# EAGLE design 3_phase (EAGLE 9.6.2)
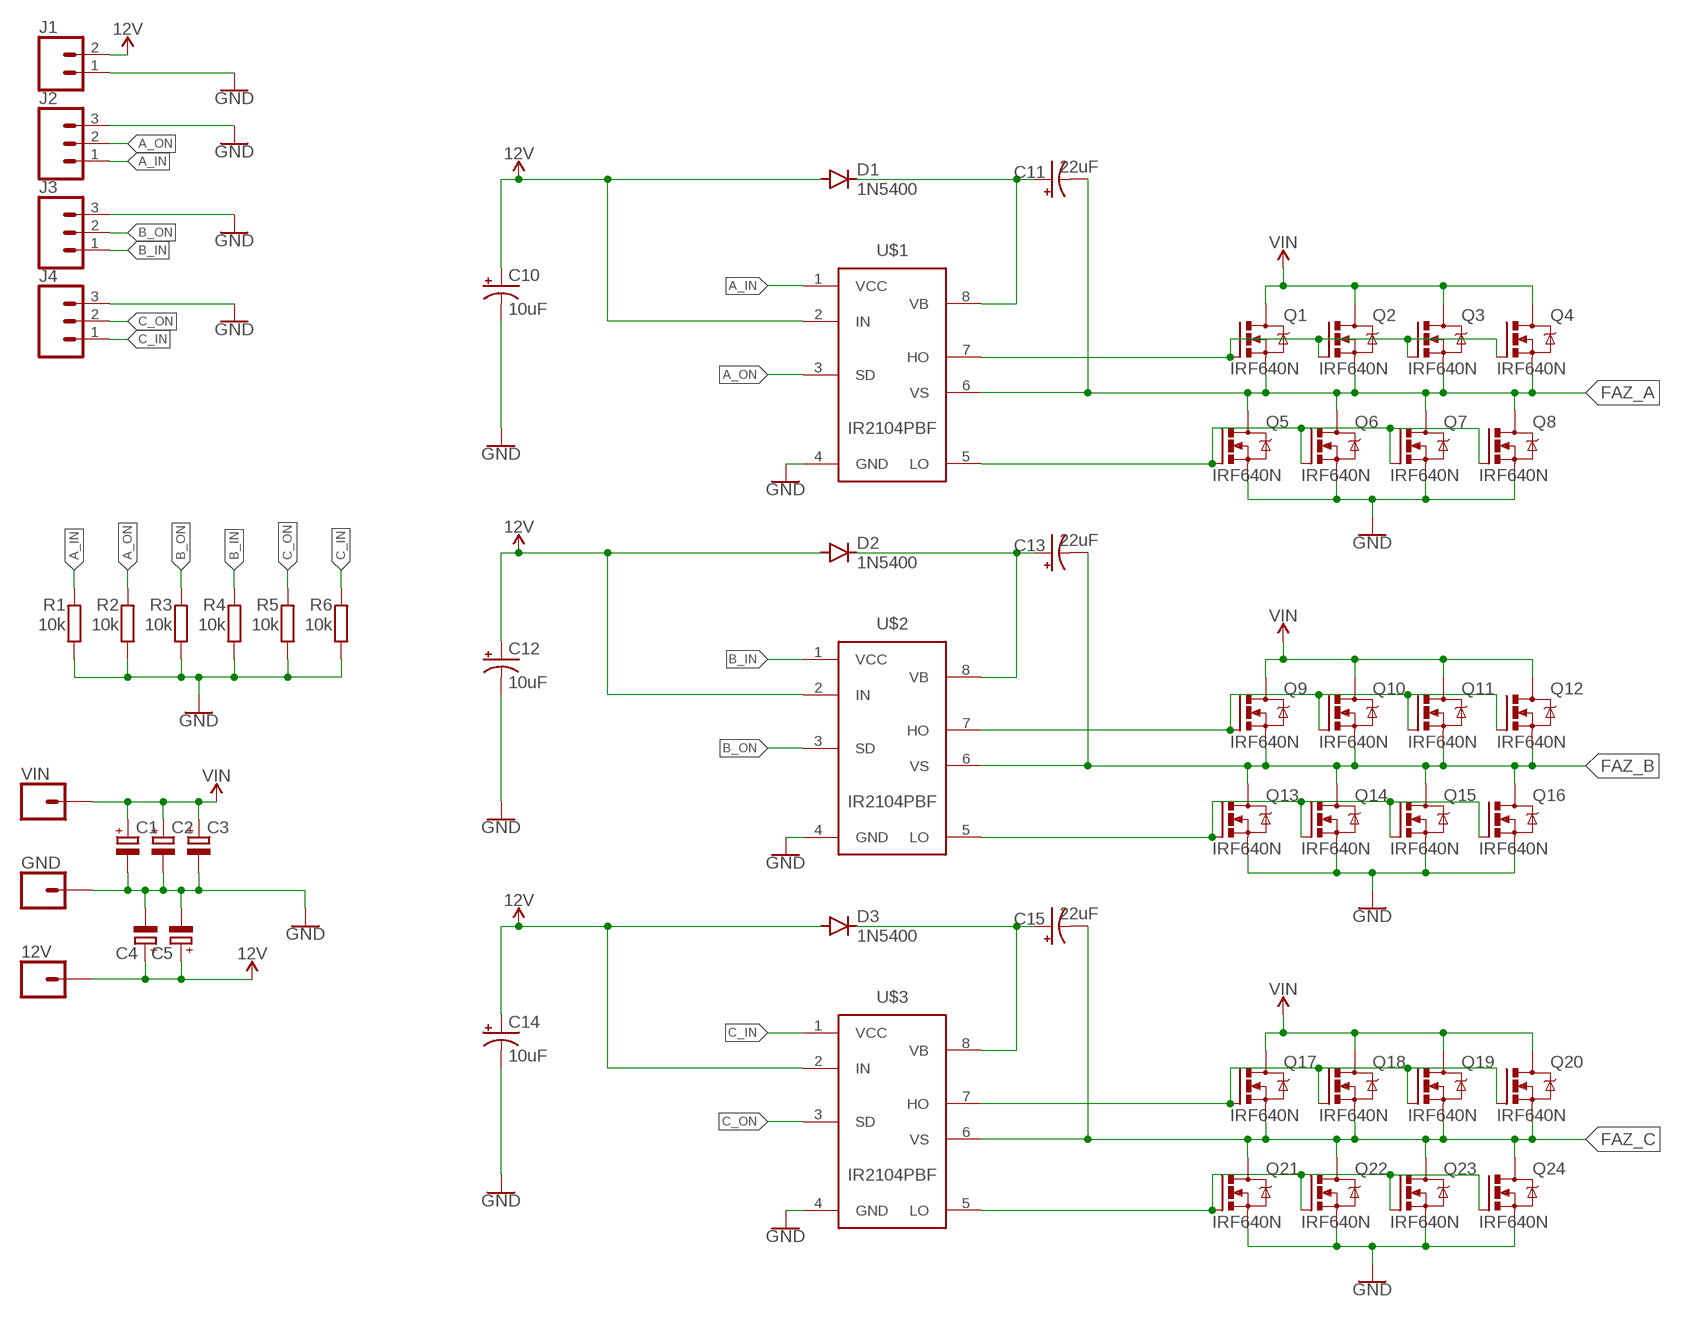
[diagram p0: schematic, sheet 1]

## Parts
12V  CONN_01SNAP-MALE  [SNAP-MALE]
C1  16MM-DIA-CAPASITOR  [16MM-DIA-CAPASITOR]
C2  16MM-DIA-CAPASITOR  [16MM-DIA-CAPASITOR]
C3  16MM-DIA-CAPASITOR  [16MM-DIA-CAPASITOR]
C4  16MM-DIA-CAPASITOR  [16MM-DIA-CAPASITOR]
C5  16MM-DIA-CAPASITOR  [16MM-DIA-CAPASITOR]
C10  10uF  10UF-POLAR-RADIAL-2.5MM-25V-20%  [CPOL-RADIAL-2.5MM-5MM]
C11  22uF  10UF-POLAR-RADIAL-2.5MM-25V-20%  [CPOL-RADIAL-2.5MM-5MM]
C12  10uF  10UF-POLAR-RADIAL-2.5MM-25V-20%  [CPOL-RADIAL-2.5MM-5MM]
C13  22uF  10UF-POLAR-RADIAL-2.5MM-25V-20%  [CPOL-RADIAL-2.5MM-5MM]
C14  10uF  10UF-POLAR-RADIAL-2.5MM-25V-20%  [CPOL-RADIAL-2.5MM-5MM]
C15  22uF  10UF-POLAR-RADIAL-2.5MM-25V-20%  [CPOL-RADIAL-2.5MM-5MM]
D1  1N5400  [DO201-15]
D2  1N5400  [DO201-15]
D3  1N5400  [DO201-15]
GND  CONN_01SNAP-MALE  [SNAP-MALE]
J1  CONN_025MM  [SCREWTERMINAL-5MM-2]
J2  CONN_03-SCREW-5MM  [SCREWTERMINAL-5MM-3]
J3  CONN_03-SCREW-5MM  [SCREWTERMINAL-5MM-3]
J4  CONN_03-SCREW-5MM  [SCREWTERMINAL-5MM-3]
Q1  IRF640N  [TO-220-PAD]
Q2  IRF640N  [TO-220-PAD]
Q3  IRF640N  [TO-220-PAD]
Q4  IRF640N  [TO-220-PAD]
Q5  IRF640N  [TO-220-PAD]
Q6  IRF640N  [TO-220-PAD]
Q7  IRF640N  [TO-220-PAD]
Q8  IRF640N  [TO-220-PAD]
Q9  IRF640N  [TO-220-PAD]
Q10  IRF640N  [TO-220-PAD]
Q11  IRF640N  [TO-220-PAD]
Q12  IRF640N  [TO-220-PAD]
Q13  IRF640N  [TO-220-PAD]
Q14  IRF640N  [TO-220-PAD]
Q15  IRF640N  [TO-220-PAD]
Q16  IRF640N  [TO-220-PAD]
Q17  IRF640N  [TO-220-PAD]
Q18  IRF640N  [TO-220-PAD]
Q19  IRF640N  [TO-220-PAD]
Q20  IRF640N  [TO-220-PAD]
Q21  IRF640N  [TO-220-PAD]
Q22  IRF640N  [TO-220-PAD]
Q23  IRF640N  [TO-220-PAD]
Q24  IRF640N  [TO-220-PAD]
R1  10k  R-EU_0207/10  [0207/10]
R2  10k  R-EU_0207/10  [0207/10]
R3  10k  R-EU_0207/10  [0207/10]
R4  10k  R-EU_0207/10  [0207/10]
R5  10k  R-EU_0207/10  [0207/10]
R6  10k  R-EU_0207/10  [0207/10]
U$1  IR2104PBF  [DIP-8]
U$2  IR2104PBF  [DIP-8]
U$3  IR2104PBF  [DIP-8]
VIN  CONN_01SNAP-MALE  [SNAP-MALE]

## Nets
12V: 12V.2 C4.+ C5.+ C10.1(+) C12.1(+) C14.1(+) D1.A D2.A D3.A J1.2 U$1.2(IN) U$2.2(IN) U$3.2(IN)
A_IN: J2.1 R1.2 U$1.1(VCC)
A_ON: J2.2 R2.2 U$1.3(SD)
B_IN: J3.1 R4.2 U$2.1(VCC)
B_ON: J3.2 R3.2 U$2.3(SD)
C_IN: J4.1 R6.2 U$3.1(VCC)
C_ON: J4.2 R5.2 U$3.3(SD)
FAZ_A: C11.2(-) Q1.3(S) Q2.3(S) Q3.3(S) Q4.3(S) Q5.TAB(D) Q6.TAB(D) Q7.TAB(D) Q8.TAB(D) U$1.6(VS)
FAZ_A_H: Q1.1(G) Q2.1(G) Q3.1(G) Q4.1(G) U$1.7(HO)
FAZ_A_L: Q5.1(G) Q6.1(G) Q7.1(G) Q8.1(G) U$1.5(LO)
FAZ_B: C13.2(-) Q9.3(S) Q10.3(S) Q11.3(S) Q12.3(S) Q13.TAB(D) Q14.TAB(D) Q15.TAB(D) Q16.TAB(D) U$2.6(VS)
FAZ_B_L: Q13.1(G) Q14.1(G) Q15.1(G) Q16.1(G) U$2.5(LO)
FAZ_B_L1: Q21.1(G) Q22.1(G) Q23.1(G) Q24.1(G) U$3.5(LO)
FAZ_C: C15.2(-) Q17.3(S) Q18.3(S) Q19.3(S) Q20.3(S) Q21.TAB(D) Q22.TAB(D) Q23.TAB(D) Q24.TAB(D) U$3.6(VS)
FAZ_C_H: Q17.1(G) Q18.1(G) Q19.1(G) Q20.1(G) U$3.7(HO)
GND: C1.- C2.- C3.- C4.- C5.- C10.2(-) C12.2(-) C14.2(-) GND.2 J1.1 J2.3 J3.3 J4.3 Q5.3(S) Q6.3(S) Q7.3(S) Q8.3(S) Q13.3(S) Q14.3(S) Q15.3(S) Q16.3(S) Q21.3(S) Q22.3(S) Q23.3(S) Q24.3(S) R1.1 R2.1 R3.1 R4.1 R5.1 R6.1 U$1.4(GND) U$2.4(GND) U$3.4(GND)
N$1: Q9.1(G) Q10.1(G) Q11.1(G) Q12.1(G) U$2.7(HO)
N$2: C11.1(+) D1.C U$1.8(VB)
N$3: C15.1(+) D3.C U$3.8(VB)
N$4: C13.1(+) D2.C U$2.8(VB)
VIN: C1.+ C2.+ C3.+ Q1.TAB(D) Q2.TAB(D) Q3.TAB(D) Q4.TAB(D) Q9.TAB(D) Q10.TAB(D) Q11.TAB(D) Q12.TAB(D) Q17.TAB(D) Q18.TAB(D) Q19.TAB(D) Q20.TAB(D) VIN.2

## Library data of the parts
12V GND VIN = SparkFun-Connectors:CONN_01: Single connection point. Often used as Generic Header-pin footprint for 0.1 inch spaced/style header connections On any of the 0.1 inch spaced packages, you can populate with these: Break Away Headers - Straight <https://www.sparkfun.com/products/116> (PRT-00116) Break Away Male Headers - Right Angle <https://www.sparkfun.com/products/553> (PRT-00553) Female Headers <https://www.sparkfun.com/products/115> (PRT-00115) Break Away Headers - Machine Pin <https://www.sparkfun.com/products/117> (PRT-00117) Break Away Female Headers - Swiss Machine Pin <https://www.sparkfun.com/products/743> (PRT-00743) This device is also useful as a general connection point to wire up your design to another part of your project. Our various solder wires solder well into these plated through hole pads. Hook-Up Wire - Assortment (Stranded, 22 AWG) <https://www.sparkfun.com/products/11375> (PRT-11375) Hook-Up Wire - Assortment (Solid Core, 22 AWG) <https://www.sparkfun.com/products/11367> (PRT-11367) View the entire wire category on our website here <https://www.sparkfun.com/categories/141> Special notes: SMTSO-256-ET is a "flush mount" nut for a 4-40 screw. We mostly use this on specialty testbeds; it is a nice way to connect hardware to your PCB at an adjustable hieght. Also note, the SNAP packages are for using a snappable style connector. We sell a baggie of snaps and they are also used on two LilyPad designs: Snap Assortment - 30 pack (male and female) <https://www.sparkfun.com/products/11347> (DEV-11347) LilyPad Arduino SimpleSnap <https://www.sparkfun.com/products/10941> (DEV-10941) LilyPad SimpleSnap Protoboard <https://www.sparkfun.com/products/10940> (DEV-10940)
C1-C5 = El_yapimi:16MM-DIA-CAPASITOR
C10 C12 C14 = SparkFun-Capacitors:10UF-POLAR: 10.0µF polarized capacitors A capacitor is a passive two-terminal electrical component used to store electrical energy temporarily in an electric field.; PROD_ID: CAP-08440
C11 C13 C15 = SparkFun-Capacitors:10UF-POLAR: 10.0µF polarized capacitors A capacitor is a passive two-terminal electrical component used to store electrical energy temporarily in an electric field.; PROD_ID: CAP-08440; VALUE: 10uF
D1-D3 = diode:1N5400: DIODE standard rectifier, 3 A, 50 V (Motorola)
J1 = SparkFun-Connectors:CONN_02: Multi connection point. Often used as Generic Header-pin footprint for 0.1 inch spaced/style header connections On any of the 0.1 inch spaced packages, you can populate with these: Break Away Headers - Straight <https://www.sparkfun.com/products/116> (PRT-00116) Break Away Male Headers - Right Angle <https://www.sparkfun.com/products/553> (PRT-00553) Female Headers <https://www.sparkfun.com/products/115> (PRT-00115) Break Away Headers - Machine Pin <https://www.sparkfun.com/products/117> (PRT-00117) Break Away Female Headers - Swiss Machine Pin <https://www.sparkfun.com/products/743> (PRT-00743) For SCREWTERMINALS and SPRING TERMINALS visit here: Screw Terimnals on SparkFun.com <https://www.sparkfun.com/search/results?term=Screw+Terminals> (5mm/3.5mm/2.54mm spacing) This device is also useful as a general connection point to wire up your design to another part of your project. Our various solder wires solder well into these plated through hole pads. Hook-Up Wire - Assortment (Stranded, 22 AWG) <https://www.sparkfun.com/products/11375> (PRT-11375) Hook-Up Wire - Assortment (Solid Core, 22 AWG) <https://www.sparkfun.com/products/11367> (PRT-11367) View the entire wire category on our website here <https://www.sparkfun.com/categories/141> Special notes: Molex polarized connector foot print use with: PRT-08233 with associated crimp pins and housings. 2.54_SCREWTERM for use with PRT-10571. 3.5mm Screw Terminal footprints for PRT-08084 5mm Screw Terminal footprints for use with PRT-08432; SF_SKU: PRT-08432
J2-J4 = SparkFun-Connectors:CONN_03: Multi connection point. Often used as Generic Header-pin footprint for 0.1 inch spaced/style header connections On any of the 0.1 inch spaced packages, you can populate with these: Break Away Headers - Straight <https://www.sparkfun.com/products/116> (PRT-00116) Break Away Male Headers - Right Angle <https://www.sparkfun.com/products/553> (PRT-00553) Female Headers <https://www.sparkfun.com/products/115> (PRT-00115) Break Away Headers - Machine Pin <https://www.sparkfun.com/products/117> (PRT-00117) Break Away Female Headers - Swiss Machine Pin <https://www.sparkfun.com/products/743> (PRT-00743) Stackable Header - 3 Pin (Female, 0.1") <https://www.sparkfun.com/products/13875> (PRT-13875) For SCREWTERMINALS and SPRING TERMINALS visit here: Screw Terimnals on SparkFun.com <https://www.sparkfun.com/search/results?term=Screw+Terminals> (5mm/3.5mm/2.54mm spacing) This device is also useful as a general connection point to wire up your design to another part of your project. Our various solder wires solder well into these plated through hole pads. Hook-Up Wire - Assortment (Stranded, 22 AWG) <https://www.sparkfun.com/products/11375> (PRT-11375) Hook-Up Wire - Assortment (Solid Core, 22 AWG) <https://www.sparkfun.com/products/11367> (PRT-11367) View the entire wire category on our website here <https://www.sparkfun.com/categories/141> Special notes: Molex polarized connector foot print use with SKU : PRT-08232 with associated crimp pins and housings.; PROD_ID: CONN-10134; SF_SKU: PRT-08433
Q1-Q24 = El_yapimi:IRF640N
R1-R6 = resistor:R-EU_: RESISTOR, European symbol
U$1-U$3 = El_yapimi:IR2104PBF

## Board
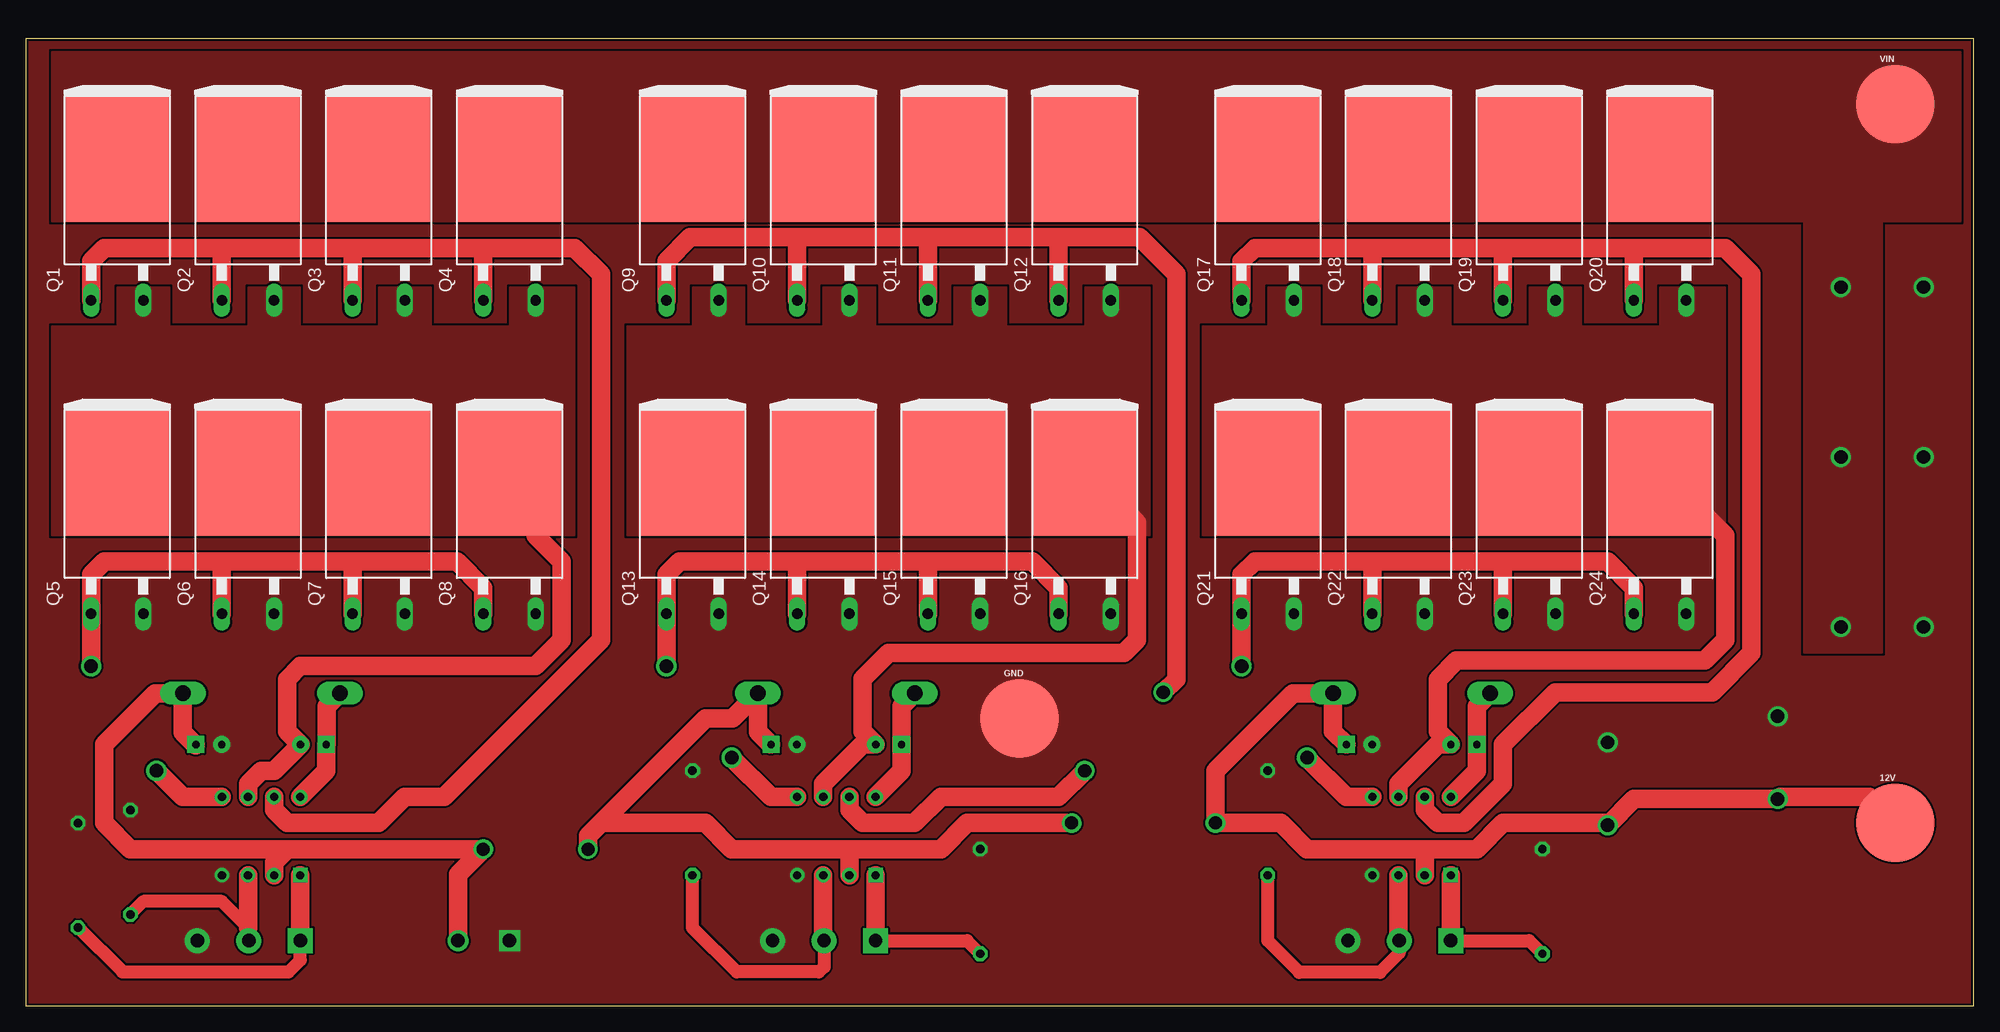
[diagram p1: board, top side]
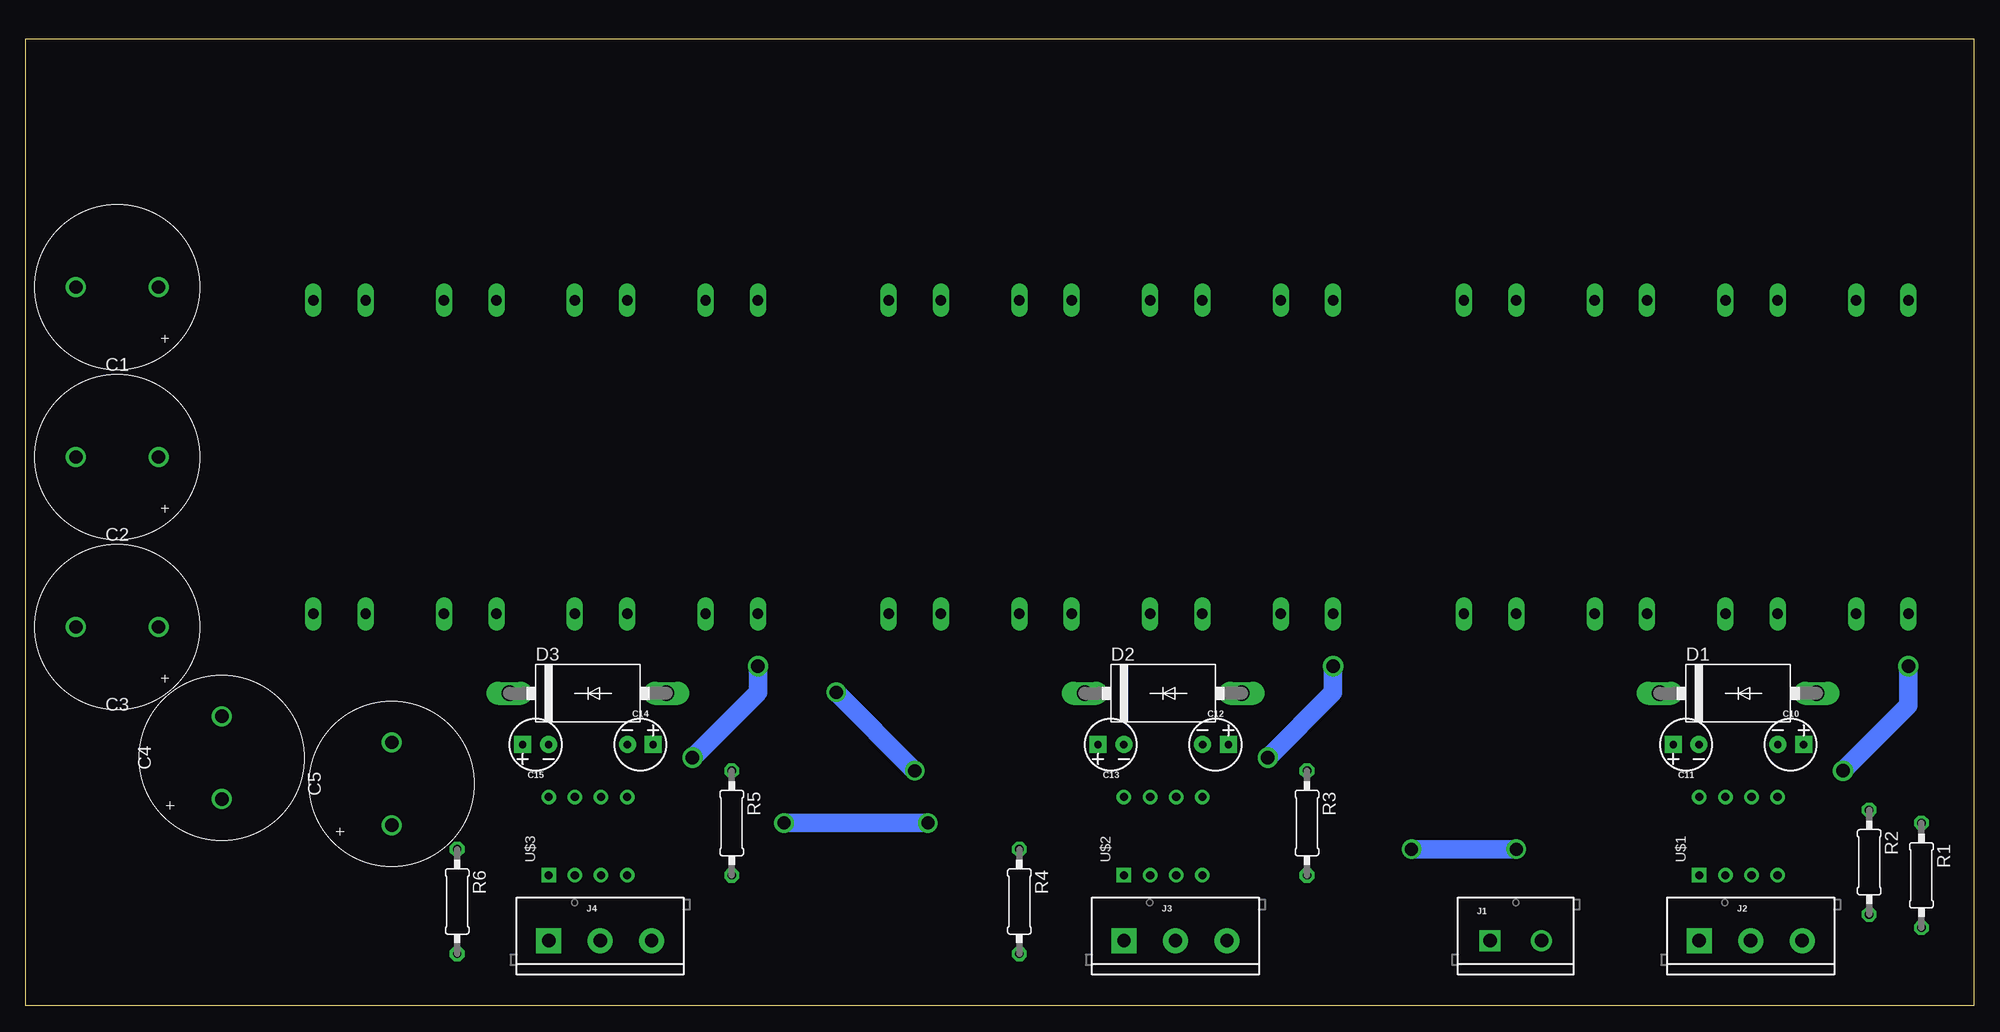
[diagram p2: board, bottom side, seen from below]

Size 189.23 x 93.98 mm. Coordinates in mm from the lower left corner, seen from the top.
Outline: 0,0 189.23,0 189.23,93.98 0,93.98 0,0
Copper layers (1*16): Top 0.035mm / dielectric 1.5mm / Bottom 0.035mm
Design rules "SparkFun": minimum track width 8mil, minimum drill 20mil, track to track 8mil, track to pad 8mil, pad to pad 8mil, via to via 8mil, smd to smd 8mil, copper to edge 10mil, drill to drill 8mil, minimum pad ring 12mil, minimum via ring 10mil, stop-mask expansion 4mil, vias tented up to drill 25mil, thermal gap 10mil

### Footprints (pad centres in the part's own frame; a part is rotated, then mirrored left to right if it is on the bottom)
SNAP-MALE = smd 7.62 x 7.62: 2 0,0
16MM-DIA-CAPASITOR = drill 1.3 pad 1.95: + -4.02,0; - 4.02,0
CPOL-RADIAL-2.5MM-5MM = drill 0.7 pad 1.651 square: 1 1.25,0 | drill 0.7 pad 1.651: 2 -1.25,0
DO201-15 = drill 1.499 long: A 7.62,0; C -7.62,0
SCREWTERMINAL-5MM-2 = drill 1.3 pad 2.032 square: 1 0,0 | drill 1.3 pad 2.032: 2 5,0
SCREWTERMINAL-5MM-3 = drill 1.3 pad 2.413 square: 1 0,0 | drill 1.3 pad 2.413: 2 5,0; 3 10,0
TO-220-PAD = drill 1.016 long: 1 -2.54,-8.89; 3 2.54,-8.89 | smd 10.16 x 12.7: TAB 0,5.08
0207/10 = drill 0.813 octagon: 1 -5.08,0; 2 5.08,0
DIP-8 = drill 0.8 square: 1 -3.81,3.81 | drill 0.8: 2 -3.81,1.27; 3 -3.81,-1.27; 4 -3.81,-3.81; 5 3.81,-3.81; 6 3.81,-1.27; 7 3.81,1.27; 8 3.81,3.81

### Placement (x,y rotation side)
12V  181.61,17.78 0 top
C1  180.34,69.85 180 bottom
C2  180.34,53.34 180 bottom
C3  180.34,36.83 180 bottom
C4  170.18,24.13 90 bottom
C5  153.67,21.59 90 bottom
C10  17.78,25.4 0 bottom
C11  27.94,25.4 180 bottom
C12  73.66,25.4 0 bottom
C13  83.82,25.4 180 bottom
C14  129.54,25.4 0 bottom
C15  139.7,25.4 180 bottom
D1  22.89,30.38 0 bottom
D2  78.74,30.38 0 bottom
D3  134.62,30.38 0 bottom
GND  96.52,27.94 0 top
J1  46.99,6.35 0 bottom
J2  26.67,6.35 0 bottom
J3  82.55,6.35 0 bottom
J4  138.43,6.35 0 bottom
Q1  8.89,77.47 0 top
Q2  21.59,77.47 0 top
Q3  34.29,77.47 0 top
Q4  46.99,77.47 0 top
Q5  8.89,46.99 0 top
Q6  21.59,46.99 0 top
Q7  34.29,46.99 0 top
Q8  46.99,46.99 0 top
Q9  64.77,77.47 0 top
Q10  77.47,77.47 0 top
Q11  90.17,77.47 0 top
Q12  102.87,77.47 0 top
Q13  64.77,46.99 0 top
Q14  77.47,46.99 0 top
Q15  90.17,46.99 0 top
Q16  102.87,46.99 0 top
Q17  120.65,77.47 0 top
Q18  133.35,77.47 0 top
Q19  146.05,77.47 0 top
Q20  158.75,77.47 0 top
Q21  120.65,46.99 0 top
Q22  133.35,46.99 0 top
Q23  146.05,46.99 0 top
Q24  158.75,46.99 0 top
R1  5.08,12.7 270 bottom
R2  10.16,13.97 270 bottom
R3  64.77,17.78 270 bottom
R4  92.71,10.16 270 bottom
R5  120.65,17.78 270 bottom
R6  147.32,10.16 270 bottom
U$1  22.86,16.51 90 bottom
U$2  78.74,16.51 90 bottom
U$3  134.62,16.51 90 bottom
VIN  181.61,87.63 0 top

### Tracks (layer width: path | path; a pad name or v marks a point on that pad's centre or on a via)
12V  (via drill 1.27)
  Top 1.778: 12V.2 179.07,20.32 170.39,20.32 C4.+ 156.21,20.11 C5.+ 153.46,17.78 143.51,17.78 140.97,15.24 135.89,15.24 | U$1.2 24.13,13.97 25.4,15.24 | 25.4,15.24 10.16,15.24 7.62,17.78 7.62,25.4 12.6,30.38 D1.A 15.27,26.57 16.49,25.34 16.49,25.36 C10.1 | 80.01,15.24 88.9,15.24 91.44,17.78 v101.6,17.78 | 80.01,15.24 68.58,15.24 66.04,17.78 55.88,17.78 | 25.4,15.24 v44.45,15.24 41.99,12.78 J1.2 | 135.89,15.24 124.46,15.24 121.92,17.78 v115.57,17.78 115.57,22.86 123.09,30.38 D3.A 127,26.67 128.27,25.4 C14.1 | 55.88,17.78 66.04,27.94 68.68,27.94 D2.A 71.12,26.65 72.37,25.4 C12.1 | U$2.2 80.01,15.24 | U$3.2 135.89,15.24 | 55.88,17.78 54.61,16.51 v54.61,15.24
  Bottom 1.778: v44.45,15.24 v54.61,15.24 | v101.6,17.78 v115.57,17.78
A_IN
  Top 1.27: R1.2 9.4,3.3 25.53,3.3 26.67,4.45 J2.1
  Top 1.778: J2.1 U$1.1
A_ON
  Top 1.27: 21.59,6.43 21.59,7.62 19.05,10.16 11.43,10.16 R2.2
  Top 1.778: 21.59,6.43 J2.2 | U$1.3 21.59,7.62
B_IN
  Top 1.27: J3.1 91.44,6.35 R4.2
  Top 1.778: J3.1 U$2.1
B_ON
  Top 1.27: J3.2 77.55,3.81 77.04,3.3 69.09,3.3 64.77,7.62 R3.2
  Top 1.778: J3.2 77.47,6.43 U$2.3
C_IN
  Top 1.27: J4.1 146.05,6.35 R6.2
  Top 1.778: J4.1 U$3.1
C_ON
  Top 1.27: J4.2 133.43,5.16 131.55,3.28 123.72,3.28 120.65,6.35 R5.2
  Top 1.778: J4.2 133.35,6.43 U$3.3
FAZ_A
  Top 1.778: 49.53,48.26 49.53,45.72 52.07,43.18 52.07,35.56 49.53,33.02 26.67,33.02 25.4,31.75 25.4,26.67 26.67,25.4 C11.2 24.15,22.86 22.86,22.86 21.59,21.59 U$1.6
  pour Top (no thermals): 8.89,69.85 8.89,66.04 2.54,66.04 2.54,45.72 53.34,45.72 53.34,69.85 46.99,69.85 46.99,66.04 39.37,66.04 39.37,69.85 34.29,69.85 34.29,66.04 26.67,66.04 26.67,69.85 21.59,69.85 21.59,66.04 13.97,66.04 13.97,69.85
FAZ_A_H
  Top 1.778: Q1.1 6.35,72.39 7.62,73.66 19.05,73.66 | 19.05,73.66 31.75,73.66 | 31.75,73.66 44.45,73.66 | 44.45,73.66 53.34,73.66 55.88,71.12 55.88,35.56 40.64,20.32 36.83,20.32 34.29,17.78 25.4,17.78 24.13,19.05 U$1.7 | Q2.1 19.05,73.66 | Q3.1 31.75,73.66 | Q4.1 44.45,73.66
FAZ_A_L  (via drill 1.3)
  Top 1.778: 19.05,43.18 7.62,43.18 6.35,41.91 Q5.1 v6.35,33.02 | 19.05,43.18 31.75,43.18 | 31.75,43.18 41.91,43.18 44.45,40.64 Q8.1 | Q7.1 31.75,43.18 | Q6.1 19.05,43.18 | v12.7,22.86 15.24,20.32 U$1.5
  Bottom 1.778: v12.7,22.86 6.35,29.21 v6.35,33.02
FAZ_B
  Top 1.778: Q16.TAB 107.95,46.99 107.95,35.56 106.68,34.29 83.82,34.29 81.3,31.77 81.3,26.67 C13.2 81.28,25.4 77.47,21.59 U$2.6
  pour Top (no thermals): 64.77,69.85 64.77,66.04 58.42,66.04 58.42,45.72 109.22,45.72 109.22,69.85 102.87,69.85 102.87,66.04 95.25,66.04 95.25,69.85 90.17,69.85 90.17,66.04 82.55,66.04 82.55,69.85 77.47,69.85 77.47,66.04 69.85,66.04 69.85,69.85
FAZ_B_L  (via drill 1.3)
  Top 1.778: 74.93,43.18 63.5,43.18 62.23,41.91 Q13.1 v62.23,33.02 | 74.93,43.18 87.63,43.18 | 87.63,43.18 97.79,43.18 100.33,40.64 Q16.1 | Q15.1 87.63,43.18 | U$2.5 72.39,20.32 v68.58,24.13 | Q14.1 74.93,43.18
  Bottom 1.778: v68.58,24.13 62.23,30.48 v62.23,33.02
FAZ_B_L1  (via drill 1.3)
  Top 1.778: Q24.1 156.21,40.64 153.67,43.18 143.51,43.18 | 130.81,43.18 119.38,43.18 118.11,41.91 Q21.1 v118.11,33.02 | 130.81,43.18 143.51,43.18 | Q23.1 143.51,43.18 | Q22.1 130.81,43.18 | U$3.5 128.27,20.32 v124.46,24.13
  Bottom 1.778: v124.46,24.13 118.11,30.48 v118.11,33.02
FAZ_C
  Top 1.778: U$3.6 133.35,21.59 137.16,25.4 C15.2 137.16,26.69 137.16,31.75 138.99,33.58 163.12,33.58 165.1,35.56 165.1,45.72 Q24.TAB
  pour Top (no thermals): 120.65,69.85 120.65,66.04 114.3,66.04 114.3,45.72 165.1,45.72 165.1,69.85 158.75,69.85 158.75,66.04 151.13,66.04 151.13,69.85 146.05,69.85 146.05,66.04 138.43,66.04 138.43,69.85 133.35,69.85 133.35,66.04 125.73,66.04 125.73,69.85
FAZ_C_H
  Top 1.778: Q17.1 118.11,72.39 119.38,73.66 130.81,73.66 | 130.81,73.66 143.51,73.66 | 143.51,73.66 156.21,73.66 | 156.21,73.66 165.1,73.66 167.64,71.12 167.64,34.29 163.83,30.48 148.59,30.48 143.51,25.4 143.51,21.59 139.7,17.78 137.16,17.78 135.89,19.05 U$3.7 | Q18.1 130.81,73.66 | Q19.1 143.51,73.66 | Q20.1 156.21,73.66
GND
  pour Top (rank 3, no thermals): -1.27,95.25 -1.27,-1.27 190.5,-1.27 190.5,95.25
N$1  (via drill 1.27)
  Top 1.778: Q9.1 62.23,72.39 64.55,74.71 74.93,74.71 | Q10.1 74.93,74.71 | 74.93,74.71 87.63,74.71 | 87.63,74.71 Q11.1 | 87.63,74.71 100.33,74.71 | 100.33,74.71 Q12.1 | 100.33,74.71 108.17,74.71 111.76,71.12 111.76,31.75 v110.49,30.48 | v102.87,22.86 100.33,20.32 88.9,20.32 86.36,17.78 81.28,17.78 80.01,19.05 U$2.7
  Bottom 1.778: v102.87,22.86 v110.49,30.48
N$2
  Top 1.524: C11.1 29.21,25.42
  Top 1.778: D1.C 29.23,29.11 29.23,25.45 C11.1 29.19,22.84 U$1.8
N$3
  Top 1.778: D3.C 140.95,29.09 C15.1 140.97,25.38 140.97,22.86 U$3.8
N$4
  Top 1.778: D2.C 85.07,29.09 C13.1 85.09,25.4 85.09,22.86 U$2.8
VIN
  pour Top (no thermals): 2.54,92.71 2.54,76.2 172.72,76.2 172.72,34.29 180.34,34.29 180.34,76.2 187.96,76.2 187.96,92.71